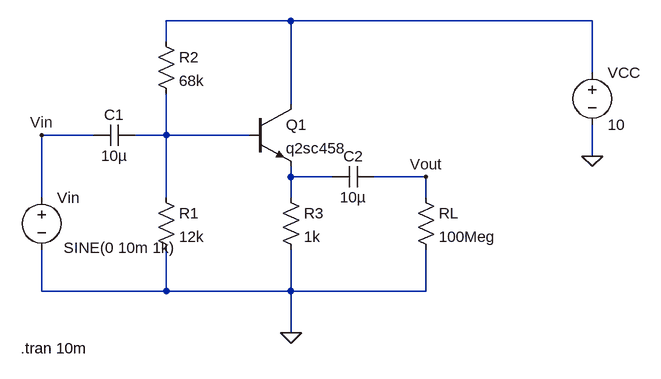
[diagram p0: schematic 1-2.asc]
1-2.asc, the LTspice schematic file:
Version 4
SHEET 1 920 680
WIRE 384 -64 192 -64
WIRE 848 -64 384 -64
WIRE 192 -32 192 -64
WIRE 848 16 848 -64
WIRE 384 64 384 -64
WIRE 80 112 0 112
WIRE 192 112 192 48
WIRE 192 112 144 112
WIRE 320 112 192 112
WIRE 848 144 848 96
WIRE 384 176 384 160
WIRE 448 176 384 176
WIRE 592 176 512 176
WIRE 0 208 0 112
WIRE 192 208 192 112
WIRE 384 208 384 176
WIRE 592 208 592 176
WIRE 0 352 0 288
WIRE 192 352 192 288
WIRE 192 352 0 352
WIRE 384 352 384 288
WIRE 384 352 192 352
WIRE 592 352 592 288
WIRE 592 352 384 352
WIRE 384 416 384 352
FLAG 384 416 0
FLAG 848 144 0
FLAG 592 176 Vout
FLAG 0 112 Vin
SYMBOL voltage 0 192 R0
WINDOW 3 34 93 Left 2
WINDOW 123 0 0 Left 0
WINDOW 39 0 0 Left 0
SYMATTR Value SINE(0 10m 1k)
SYMATTR InstName Vin
SYMBOL cap 144 96 R90
WINDOW 0 0 32 VBottom 2
WINDOW 3 32 32 VTop 2
SYMATTR InstName C1
SYMATTR Value 10µ
SYMBOL res 176 192 R0
SYMATTR InstName R1
SYMATTR Value 12k
SYMBOL res 176 -48 R0
SYMATTR InstName R2
SYMATTR Value 68k
SYMBOL npn 320 64 R0
SYMATTR InstName Q1
SYMATTR Value q2sc458
SYMBOL res 368 192 R0
SYMATTR InstName R3
SYMATTR Value 1k
SYMBOL cap 512 160 R90
WINDOW 0 0 32 VBottom 2
WINDOW 3 32 32 VTop 2
SYMATTR InstName C2
SYMATTR Value 10µ
SYMBOL res 576 192 R0
SYMATTR InstName RL
SYMATTR Value 100Meg
SYMBOL voltage 848 0 R0
WINDOW 123 0 0 Left 0
WINDOW 39 0 0 Left 0
SYMATTR InstName VCC
SYMATTR Value 10
TEXT -32 440 Left 2 !.tran 10m

The netlist it stands for:
* 1-2.asc
Vin Vin 0 SINE(0 10m 1k)
C1 N002 Vin 10µ
R1 N002 0 12k
R2 N001 N002 68k
Q1 N001 N002 N003 0 q2sc458
R3 N003 0 1k
C2 Vout N003 10µ
RL Vout 0 100Meg
VCC N001 0 10
.model NPN NPN
.model PNP PNP
.lib standard.bjt
.tran 10m
.backanno
.end